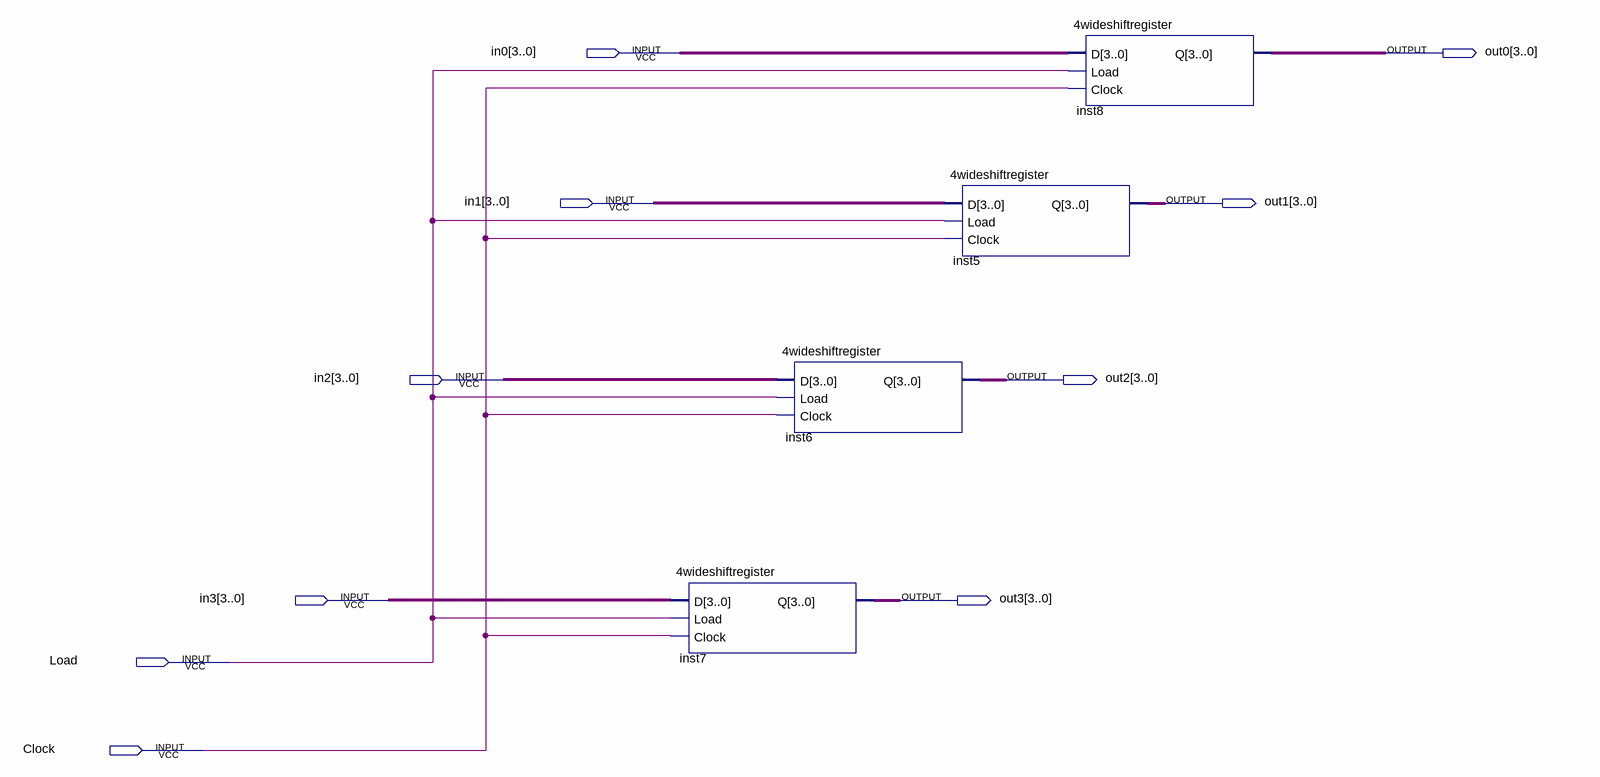
[diagram p0: schematic sheet]
// Quartus schematic 4registerstorage.bdf as structural Verilog: 4 symbols, 10 pins
module \4registerstorage  (
  input  [3:0] in0,
  input  [3:0] in1,
  input  [3:0] in2,
  input  [3:0] in3,
  input  Load,
  input  Clock,
  output [3:0] out0,
  output [3:0] out1,
  output [3:0] out2,
  output [3:0] out3
);

  \4wideshiftregister  inst7 (.D(in3), .Load(Load), .Clock(Clock), .Q(out3));
  \4wideshiftregister  inst6 (.D(in2), .Load(Load), .Clock(Clock), .Q(out2));
  \4wideshiftregister  inst5 (.D(in1), .Load(Load), .Clock(Clock), .Q(out1));
  \4wideshiftregister  inst8 (.D(in0), .Load(Load), .Clock(Clock), .Q(out0));
endmodule
